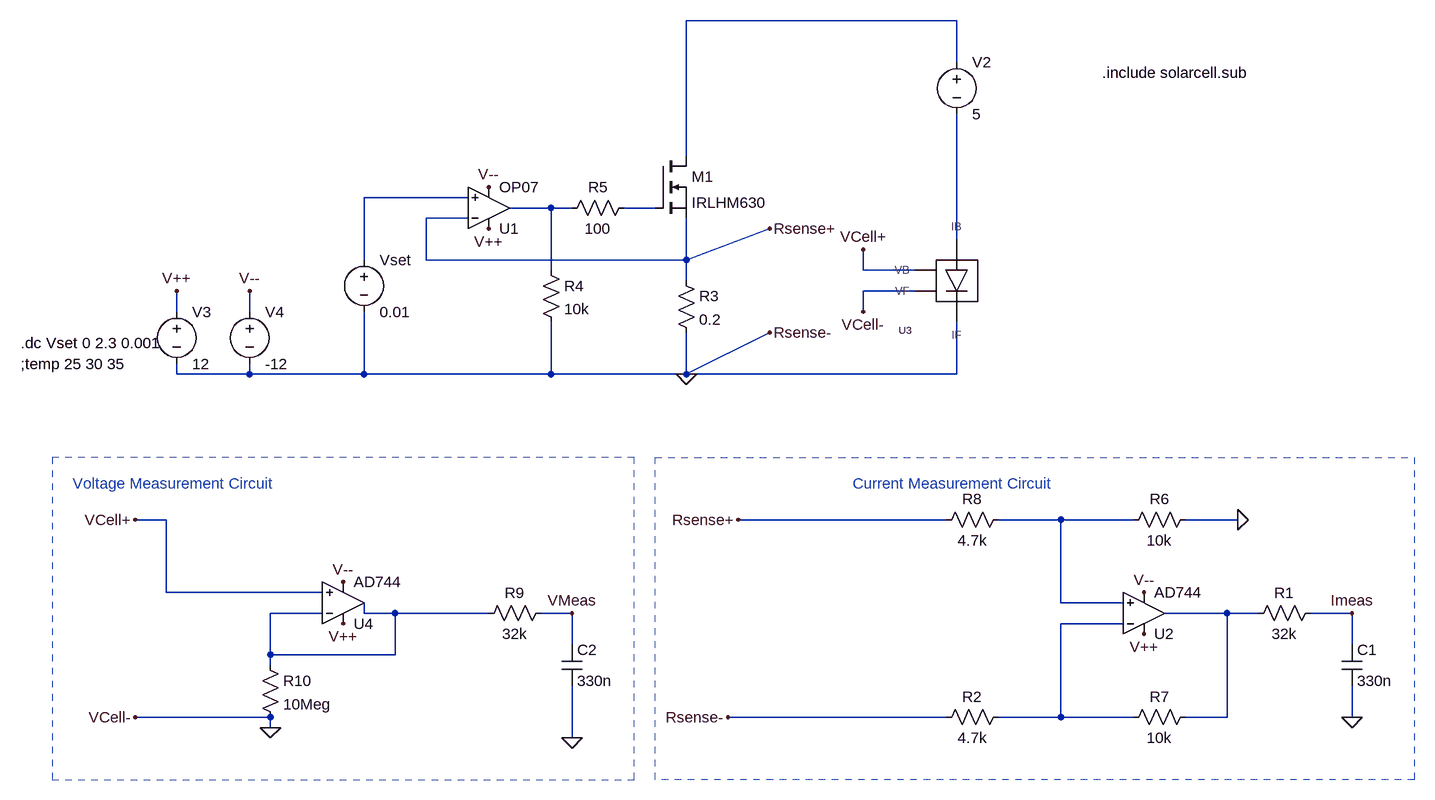
[diagram p0: schematic IVTesterFullCircuit - FIMV_single-1k.asc]
IVTesterFullCircuit - FIMV_single-1k.asc, the LTspice schematic file:
Version 4
SHEET 1 1572 1044
WIRE 864 -128 448 -128
WIRE 864 -64 864 -128
WIRE 448 80 448 -128
WIRE 112 144 -48 144
WIRE 240 160 176 160
WIRE 272 160 240 160
WIRE 400 160 352 160
WIRE 112 176 48 176
WIRE 864 208 864 16
WIRE -48 240 -48 144
WIRE 48 240 48 176
WIRE 448 240 448 176
WIRE 448 240 576 192
WIRE 448 240 48 240
WIRE 240 256 240 160
WIRE 720 256 720 224
WIRE 800 256 720 256
WIRE 448 272 448 240
WIRE 800 288 720 288
WIRE -336 320 -336 288
WIRE -224 320 -224 288
WIRE 720 320 720 288
WIRE -336 416 -336 400
WIRE -224 416 -224 400
WIRE -224 416 -336 416
WIRE -48 416 -48 320
WIRE -48 416 -224 416
WIRE 240 416 240 336
WIRE 240 416 -48 416
WIRE 448 416 448 352
WIRE 448 416 576 352
WIRE 448 416 240 416
WIRE 864 416 864 336
WIRE 864 416 448 416
WIRE -352 640 -400 640
WIRE 848 640 528 640
WIRE 1024 640 928 640
WIRE 1136 640 1024 640
WIRE 1296 640 1216 640
WIRE -352 752 -352 640
WIRE -112 752 -352 752
WIRE 1024 768 1024 640
WIRE 1120 768 1024 768
WIRE -112 784 -192 784
WIRE -48 784 -48 768
WIRE 0 784 -48 784
WIRE 144 784 0 784
WIRE 272 784 224 784
WIRE 1280 784 1184 784
WIRE 1328 784 1280 784
WIRE 1472 784 1408 784
WIRE 1120 800 1024 800
WIRE 272 832 272 784
WIRE 1472 832 1472 784
WIRE -192 848 -192 784
WIRE 0 848 0 784
WIRE 0 848 -192 848
WIRE -192 864 -192 848
WIRE -192 944 -400 944
WIRE 848 944 512 944
WIRE 1024 944 1024 800
WIRE 1024 944 928 944
WIRE 1136 944 1024 944
WIRE 1280 944 1280 784
WIRE 1280 944 1216 944
WIRE 1472 944 1472 896
WIRE -192 960 -192 944
WIRE 272 976 272 896
FLAG -336 288 V++
FLAG -224 288 V--
FLAG 144 192 V++
FLAG 144 128 V--
FLAG 448 416 0
FLAG 720 224 VCell+
FLAG 1296 640 0
FLAG 1472 944 0
FLAG 512 944 Rsense-
FLAG 528 640 Rsense+
FLAG 1472 784 Imeas
FLAG 272 976 0
FLAG -400 640 VCell+
FLAG 272 784 VMeas
FLAG -400 944 VCell-
FLAG 720 320 VCell-
FLAG 576 192 Rsense+
FLAG 576 352 Rsense-
FLAG 1152 816 V++
FLAG 1152 752 V--
FLAG -80 800 V++
FLAG -80 736 V--
FLAG -192 960 0
SYMBOL voltage -48 224 R0
WINDOW 123 0 0 Left 0
WINDOW 39 0 0 Left 0
SYMATTR InstName Vset
SYMATTR Value 0.01
SYMBOL voltage 864 -80 R0
WINDOW 123 0 0 Left 0
WINDOW 39 0 0 Left 0
SYMATTR InstName V2
SYMATTR Value 5
SYMBOL res 432 256 R0
SYMATTR InstName R3
SYMATTR Value 0.2
SYMBOL nmos 400 80 R0
SYMATTR InstName M1
SYMATTR Value IRLHM630
SYMBOL OpAmps\\OP07 144 224 M180
SYMATTR InstName U1
SYMBOL voltage -336 304 R0
WINDOW 123 0 0 Left 0
WINDOW 39 0 0 Left 0
SYMATTR InstName V3
SYMATTR Value 12
SYMBOL voltage -224 304 R0
WINDOW 123 0 0 Left 0
WINDOW 39 0 0 Left 0
SYMATTR InstName V4
SYMATTR Value -12
SYMBOL res 224 240 R0
SYMATTR InstName R4
SYMATTR Value 10k
SYMBOL res 368 144 R90
WINDOW 0 0 56 VBottom 2
WINDOW 3 32 56 VTop 2
SYMATTR InstName R5
SYMATTR Value 100
SYMBOL res 1424 768 R90
WINDOW 0 0 56 VBottom 2
WINDOW 3 32 56 VTop 2
SYMATTR InstName R1
SYMATTR Value 32k
SYMBOL cap 1456 832 R0
SYMATTR InstName C1
SYMATTR Value 330n
SYMBOL res 944 928 R90
WINDOW 0 0 56 VBottom 2
WINDOW 3 32 56 VTop 2
SYMATTR InstName R2
SYMATTR Value 4.7k
SYMBOL res 1232 624 R90
WINDOW 0 0 56 VBottom 2
WINDOW 3 32 56 VTop 2
SYMATTR InstName R6
SYMATTR Value 10k
SYMBOL res 1232 928 R90
WINDOW 0 0 56 VBottom 2
WINDOW 3 32 56 VTop 2
SYMATTR InstName R7
SYMATTR Value 10k
SYMBOL OpAmps\\AD744 1152 848 M180
SYMATTR InstName U2
SYMBOL res 944 624 R90
WINDOW 0 0 56 VBottom 2
WINDOW 3 32 56 VTop 2
SYMATTR InstName R8
SYMATTR Value 4.7k
SYMBOL res 240 768 R90
WINDOW 0 0 56 VBottom 2
WINDOW 3 32 56 VTop 2
SYMATTR InstName R9
SYMATTR Value 32k
SYMBOL cap 256 832 R0
SYMATTR InstName C2
SYMATTR Value 330n
SYMBOL solarcell 864 320 R180
SYMATTR InstName U3
SYMBOL OpAmps\\AD744 -80 832 M180
SYMATTR InstName U4
SYMBOL res -208 848 R0
SYMATTR InstName R10
SYMATTR Value 10Meg
TEXT -576 368 Left 2 !.dc Vset 0 2.3 0.001
TEXT -576 400 Left 2 !;temp 25 30 35
TEXT 704 584 Left 2 ;Current Measurement Circuit
TEXT -496 584 Left 2 ;Voltage Measurement Circuit
TEXT 1088 -48 Left 2 !.include solarcell.sub
RECTANGLE Normal 1568 1040 400 544 2
RECTANGLE Normal -528 1040 368 544 2

The netlist it stands for:
* IVTesterFullCircuit - FIMV_single-1k.asc
Vset N002 0 0.01
V2 N001 N005 5
R3 Rsense+ 0 0.2
M1 N001 N004 Rsense+ Rsense+ IRLHM630
XU1 N002 Rsense+ V++ V-- N003 LT1001  ; OP07, pins In+ In- V+ V- OUT
V3 V++ 0 12
V4 V-- 0 -12
R4 N003 0 10k
R5 N004 N003 100
R1 Imeas N008 32k
C1 Imeas 0 330n
R2 N009 0 4.7k
R6 0 N006 10k
R7 N008 N009 10k
XU2 N006 N009 V++ V-- N008 AD744  ; pins In+ In- V+ V- OUT
R8 N006 Rsense+ 4.7k
R9 VMeas N007 32k
C2 VMeas 0 330n
XU3 0 N005 0 VCell+ solarcell  ; pins IF IB VF VB
XU4 VCell+ N007 V++ V-- N007 AD744  ; pins In+ In- V+ V- OUT
R10 N007 0 10Meg
.model NMOS NMOS
.model PMOS PMOS
.lib standard.mos
.dc Vset 0 2.3 0.001
;temp 25 30 35
* Current Measurement Circuit
* Voltage Measurement Circuit
.include solarcell.sub
.lib LTC.lib
.backanno
.end

* Results of the author's LTspice run, read from the files saved beside the schematic
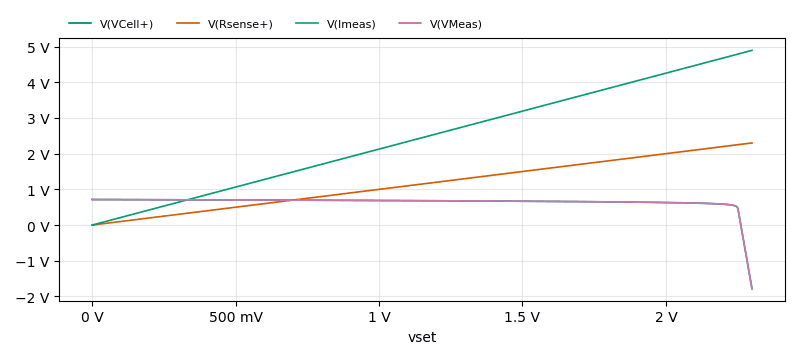
[diagram p1: DC transfer characteristic of IVTesterFullCircuit - FIMV_single-1k.asc, plotted from the saved traces]
* DC transfer characteristic, 1 run:
*   V(VCell+): 715.7 mV at vset=0 V, -1.785 V at vset=2.3 V, min -1.785 V, max 715.7 mV
*   V(Rsense+): 536.2 pV at vset=0 V, 2.3 V at vset=2.3 V, min 536.2 pV, max 2.3 V
*   V(Imeas): 1.141 nV at vset=0 V, 4.894 V at vset=2.3 V, min 1.141 nV, max 4.894 V
*   V(VMeas): 715.7 mV at vset=0 V, -1.785 V at vset=2.3 V, min -1.785 V, max 715.7 mV